# Altium project Sayma_RTM.PrjPcb (part 6 of 11)

## Sheet SI5324_CDR_WR_clocks.SchDoc: Sayma RTM
size 420 x 297 mm; $$Internal___BlkDate: 23:43:25_12-13-18; $$Internal_NAME_PLACEHOLDER: a3sheet; $$Internal_Resolution: 00001mm; $$NotCommonProperty_@NAME: SI5324_CLK_RECOVERY; $$NotCommonProperty_@PRINTORDER: 22; $$NotCommonProperty_@SHEET: 1; $$NotCommonProperty_@SHEETTOTAL: 16; CmpIndex: 26; Drawing Author: G.Kasprowicz; Drawing Number: Sayma RTM; Drawing Project: 8 channel SAWG; Drawing Revision: 2.0; SymIndex: 2227; Author: G.Kasprowicz; CompanyName: WUT ISE; DrawnBy: G.Kasprowicz; Organization: WUT ISE; Address1: PW ISE; Address2: Nowowiejska 15/19 00-665 Warsaw; Address3: gkasprow@gmail.com; DocumentNumber: 4; Revision: 1.0; SheetNumber: 4; SheetTotal: 18; ModifiedBy: -; CheckedDate: -; Title2: CDR (Si5324) & WR clocks; DivGrp: WUT ISE; Designer: G.Kasprowicz; ModifiedDate: -; ProjectName: Sensor Box
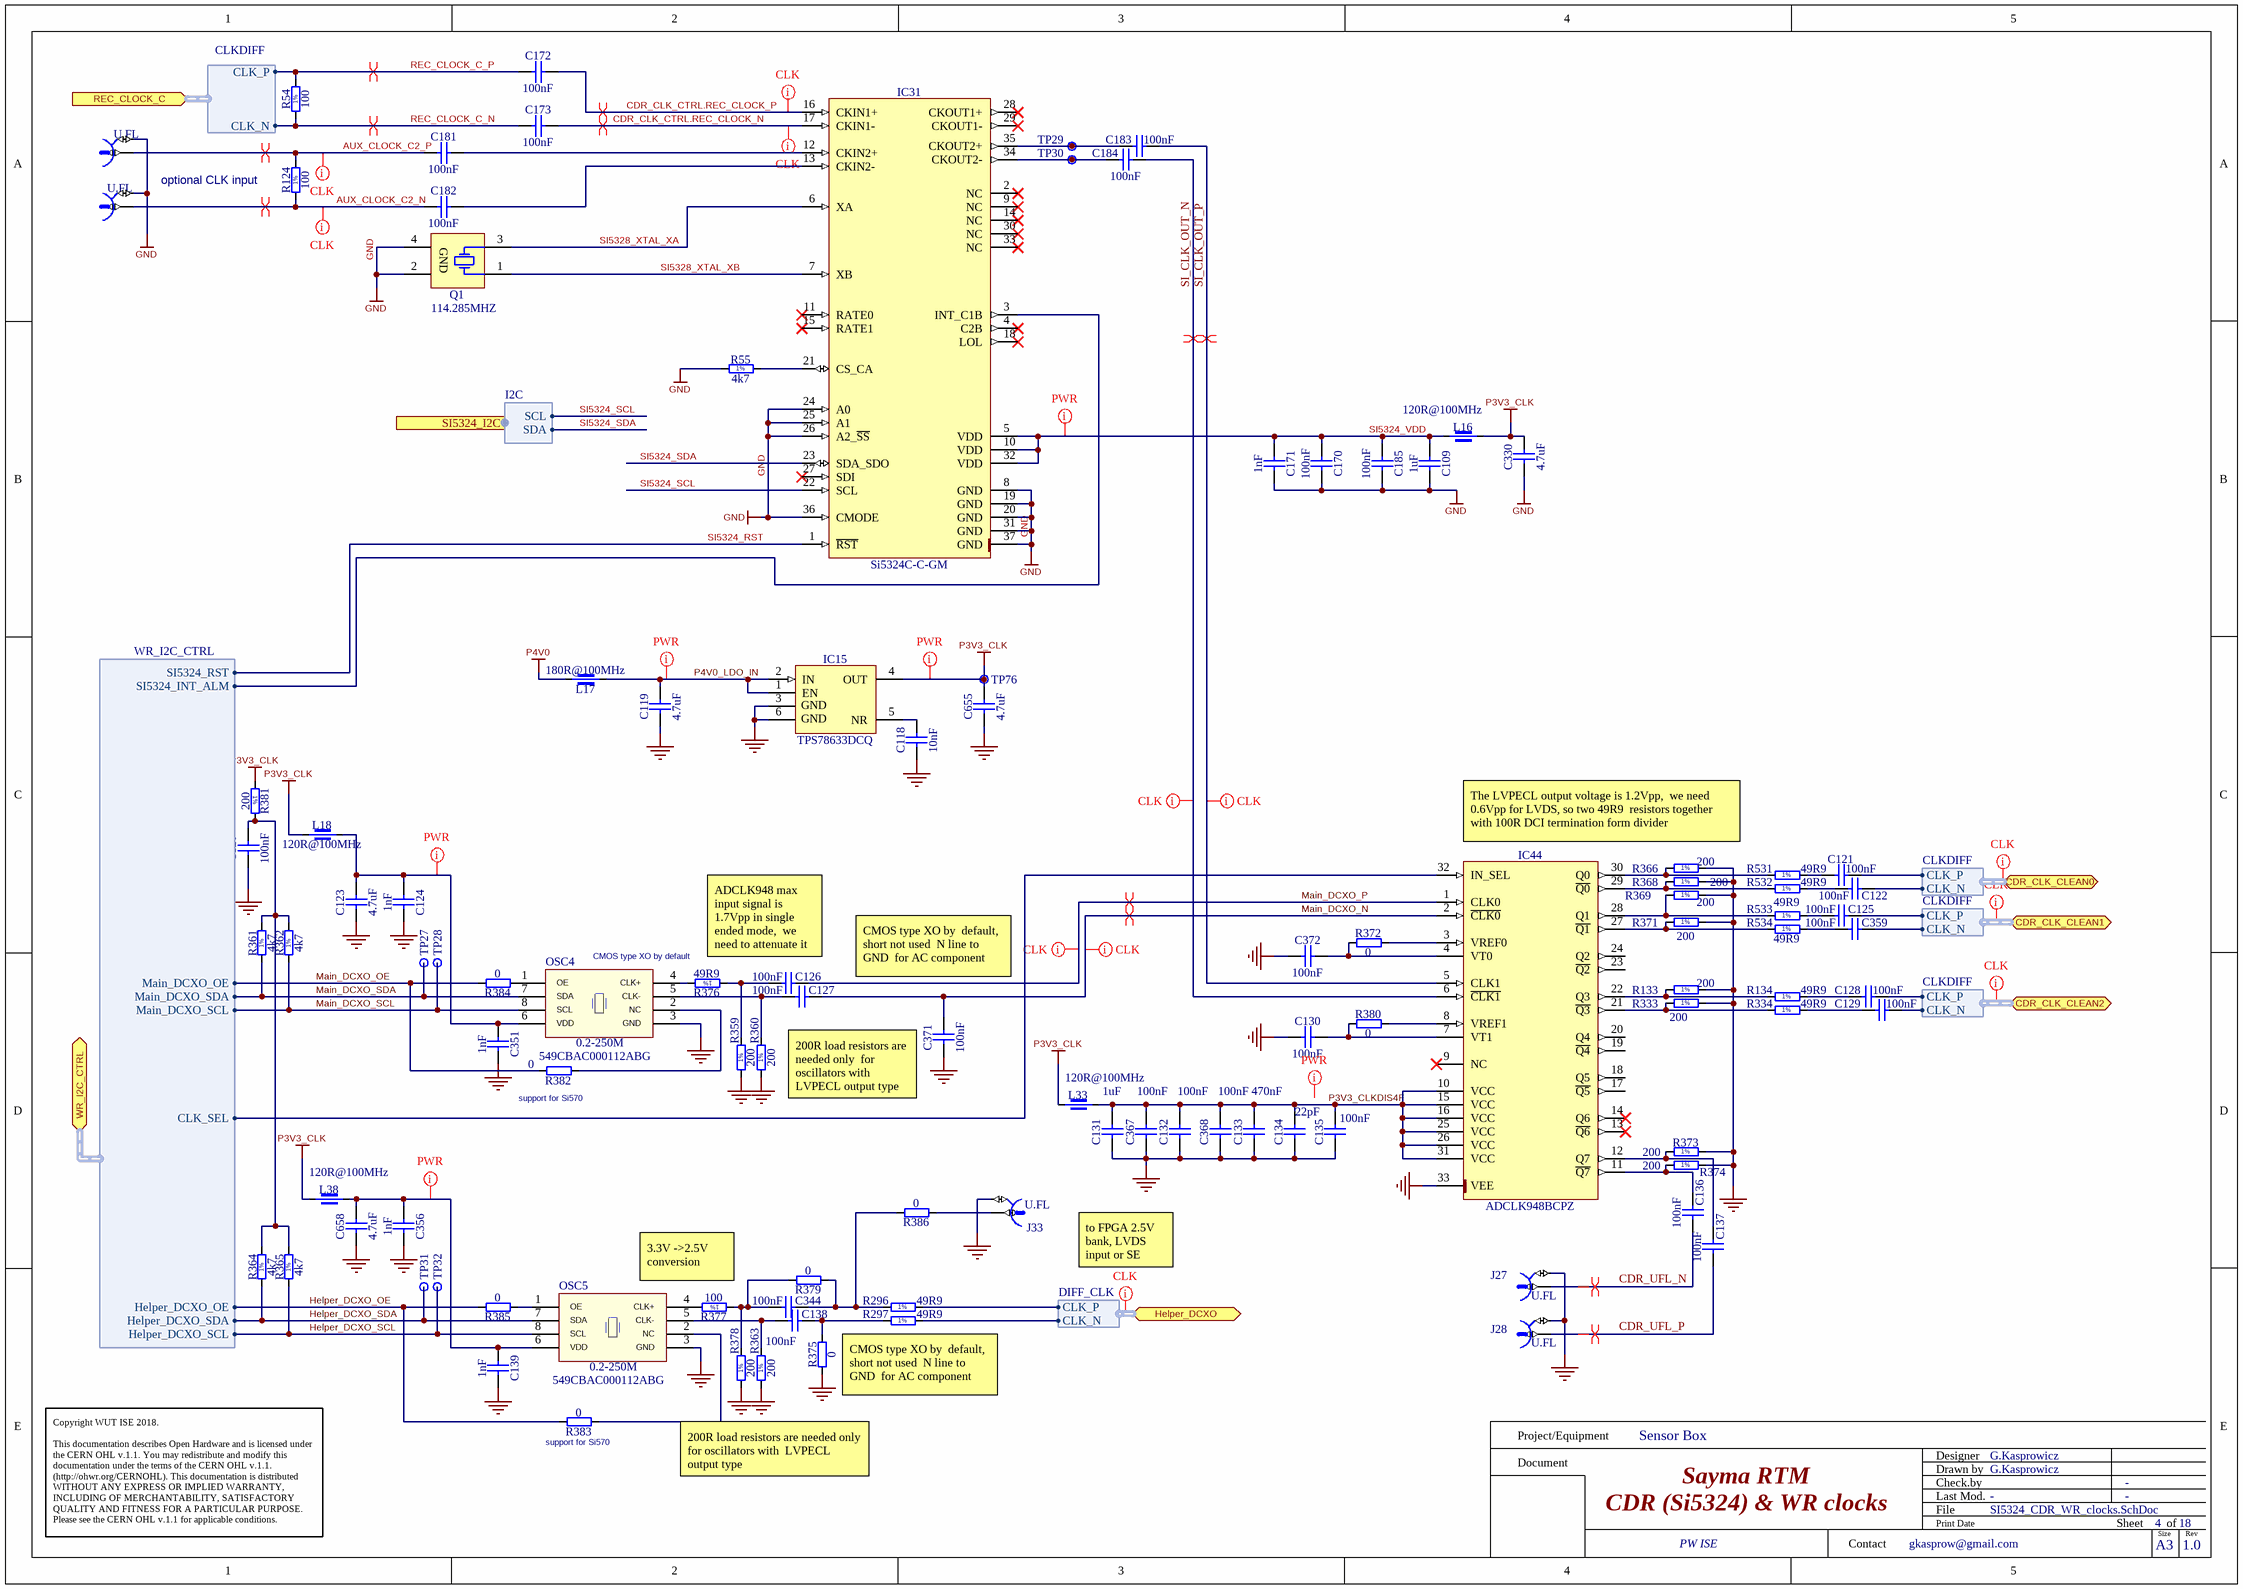
[diagram p9: SI5324_CDR_WR_clocks.SchDoc]

### Parts
C109  1uF  [CAPC1005X55N]
C118  10nF  [CAPC1608X87N]
C119  4.7uF  [CAPC1608X90N]
C120  100nF  [CAPC0603X33N]
C121  100nF  [CAPC0603X33N]
C122  100nF  [CAPC0603X33N]
C123  4.7uF  [CAPC1608X90N]
C124  1nF  [CAPC0603X33N]
C125  100nF  [CAPC0603X33N]
C126  100nF  [CAPC1005X55N]
C127  100nF  [CAPC1005X55N]
C128  100nF  [CAPC0603X33N]
C129  100nF  [CAPC0603X33N]
C130  100nF  [CAPC0603X33N]
C131  1uF  [CAPC1005X55N]
C132  100nF  [CAPC0603X33N]
C133  470nF  [CAPC1005X55N]
C134  22pF  [CAPC1005X55N]
C135  100nF  [CAPC0603X33N]
C136  100nF  [CAPC0603X33N]
C137  100nF  [CAPC0603X33N]
C138  100nF  [CAPC1005X55N]
C139  1nF  [CAPC0603X33N]
C170  100nF  [CAPC0603X33N]
C171  1nF  [CAPC0603X33N]
C172  100nF  [CAPC0603X33N]
C173  100nF  [CAPC0603X33N]
C181  100nF  [CAPC0603X33N]
C182  100nF  [CAPC0603X33N]
C183  100nF  [CAPC0603X33N]
C184  100nF  [CAPC0603X33N]
C185  100nF  [CAPC0603X33N]
C330  4.7uF  [CAPC1608X90N]
C344  100nF  [CAPC1005X55N]
C351  1nF  [CAPC0603X33N]
C356  1nF  [CAPC0603X33N]
C359  100nF  [CAPC0603X33N]
C367  100nF  [CAPC0603X33N]
C368  100nF  [CAPC0603X33N]
C371  100nF  [CAPC0603X33N]
C372  100nF  [CAPC0603X33N]
C655  4.7uF  [CAPC1608X90N]
C658  4.7uF  [CAPC1608X90N]
IC15  TPS78633DCQ  [SOT127P700X180-6N]
IC31  Si5324C-C-GM  [QFN50P600X600X90-37N-S425]
IC44  ADCLK948BCPZ  [QFN50P500X500X80-33N-S285]
J5  U.FL  [HIROSE_U.FL-R-SMT-1(10)]
J6  U.FL  [HIROSE_U.FL-R-SMT-1(10)]
J27  U.FL  [HIROSE_U.FL-R-SMT-1(10)]
J28  U.FL  [HIROSE_U.FL-R-SMT-1(10)]
J33  U.FL  [HIROSE_U.FL-R-SMT-1(10)]
L16  120R@100MHz  [INDC1608X95N]
L17  180R@100MHz  [INDC4516X180N]
L18  120R@100MHz  [INDC1608X95N]
L33  120R@100MHz  [INDC1608X95N]
L38  120R@100MHz  [INDC1608X95N]
OSC4  0.2-250M  Manufacturer Part Number: 549CBAC000112ABG  [OSC_SILICON-LAB_SI549]
OSC5  0.2-250M  Manufacturer Part Number: 549CBAC000112ABG  [OSC_SILICON-LAB_SI549]
Q1  114.285MHZ  [XTAL_CONNOR_CS]
R54  100  [RESC1005X40N]
R55  4k7  [RESC1005X40N]
R124  100  [RESC1005X40N]
R133  200  [RESC1005X40N]
R134  49R9  [RESC1005X40N]
R296  49R9  [RESC1005X40N]
R297  49R9  [RESC1005X40N]
R333  200  [RESC1005X40N]
R334  49R9  [RESC1005X40N]
R359  200  [RESC1005X40N]
R360  200  [RESC1005X40N]
R361  4k7  [RESC1005X40N]
R362  4k7  [RESC1005X40N]
R363  200  [RESC1005X40N]
R364  4k7  [RESC1005X40N]
R365  4k7  [RESC1005X40N]
R366  200  [RESC1005X40N]
R368  200  [RESC1005X40N]
R369  200  [RESC1005X40N]
R371  200  [RESC1005X40N]
R372  0  [RESC1005X40N]
R373  200  [RESC1005X40N]
R374  200  [RESC1005X40N]
R375  0  [RESC1005X40N]
R376  49R9  [RESC1005X40N]
R377  100  [RESC1005X40N]
R378  200  [RESC1005X40N]
R379  0  [RESC1005X40N]
R380  0  [RESC1005X40N]
R381  200  [RESC1005X40N]
R382  0  [RESC1005X40N]
R383  0  [RESC1005X40N]
R384  0  [RESC1005X40N]
R385  0  [RESC1005X40N]
R386  0  [RESC1005X40N]
R531  49R9  [RESC1005X40N]
R532  49R9  [RESC1005X40N]
R533  49R9  [RESC1005X40N]
R534  49R9  [RESC1005X40N]
TP27  Test Point  [TPS127]  (value not drawn)
TP28  Test Point  [TPS127]  (value not drawn)
TP29  Test Point  [TPS127]  (value not drawn)
TP30  Test Point  [TPS127]  (value not drawn)
TP31  Test Point  [TPS127]  (value not drawn)
TP32  Test Point  [TPS127]  (value not drawn)
TP76  Test Point  [TPS127]  (value not drawn)

### Ports
CDR_CLK_CLEAN0 (bidir, harness CLKDIFF), CDR_CLK_CLEAN1 (bidir, harness CLKDIFF), CDR_CLK_CLEAN2 (bidir, harness CLKDIFF), Helper_DCXO (bidir, harness DIFF_CLK), REC_CLOCK_C (in, harness CLKDIFF), SI5324_I2C (harness I2C), WR_I2C_CTRL (bidir, harness WR_I2C_CTRL)

### Harnesses
I2C: SDA, SCL
CLKDIFF: CLK_N, CLK_P
DIFF_CLK: CLK_N, CLK_P
WR_I2C_CTRL: Main_DCXO_OE, Main_DCXO_SDA, Main_DCXO_SCL, Helper_DCXO_OE, Helper_DCXO_SDA, Helper_DCXO_SCL, CLK_SEL, SI5324_RST, SI5324_INT_ALM

### Nets
GND: C109.2 C118.1 C119.1 C120.1 C123.1 C124.1 C130.1 C131.2 C132.1 C133.1 C134.1 C135.1 C139.1 C170.1 C171.1 C185.1 C330.1 C351.1 C356.1 C367.1 C368.1 C371.1 C372.1 C655.1 C658.1 IC15.3(GND) IC15.6(GND) IC31.8(GND) IC31.19(GND) IC31.20(GND) IC31.24(A0) IC31.25(A1) IC31.26(A2_~{SS}) IC31.31(GND) IC31.36(CMODE) IC31.37(GND) IC44.33(VEE) J5.2 J6.2 J27.2 J28.2 J33.2 OSC4.3(GND) OSC5.3(GND) Q1.2(GND) Q1.4(GND) R55.1 R133.2 R333.2 R359.1 R360.1 R363.1 R366.2 R368.2 R369.2 R371.2 R373.2 R374.2 R375.1 R378.1
P3V3_CLK: C330.2 C655.2 IC15.4(OUT) L16.1 L18.1 L33.1 L38.1 R381.1 TP76.1
P4V0: L17.1
AUX_CLOCK_C2_N: C182.2 J6.1 R124.1
AUX_CLOCK_C2_P: C181.2 J5.1 R124.2
CDR_CLK_CLEAN2_N: C129.2 ; port CDR_CLK_CLEAN2.CLK_N
CDR_CLK_CLEAN2_P: C128.2 ; port CDR_CLK_CLEAN2.CLK_P
CDR_CLK_CLEAN3_N: C122.2 ; port CDR_CLK_CLEAN0.CLK_N
CDR_CLK_CLEAN3_P: C121.2 ; port CDR_CLK_CLEAN0.CLK_P
CDR_CLK_CTRL.CDR_CLK_CLEAN1_N: C359.2 ; port CDR_CLK_CLEAN1.CLK_N
CDR_CLK_CTRL.CDR_CLK_CLEAN1_P: C125.2 ; port CDR_CLK_CLEAN1.CLK_P
CDR_CLK_CTRL.REC_CLOCK_N: C173.1 IC31.17(CKIN1-)
CDR_CLK_CTRL.REC_CLOCK_P: C172.1 IC31.16(CKIN1+)
CDR_UFL_N: C136.2 J27.1
CDR_UFL_P: C137.2 J28.1
Helper_DCXO_N: R297.2 ; port Helper_DCXO.CLK_N
Helper_DCXO_OE: R383.2 R385.2 ; port WR_I2C_CTRL.Helper_DCXO_OE
Helper_DCXO_P: R296.2 ; port Helper_DCXO.CLK_P
Helper_DCXO_SCL: OSC5.8(SCL) R365.1 TP32.1 ; port WR_I2C_CTRL.Helper_DCXO_SCL
Helper_DCXO_SDA: OSC5.7(SDA) R364.1 TP31.1 ; port WR_I2C_CTRL.Helper_DCXO_SDA
Main_DCXO_N: C127.2 C371.2 IC44.2(~{CLK0})
Main_DCXO_OE: R382.2 R384.2 ; port WR_I2C_CTRL.Main_DCXO_OE
Main_DCXO_P: C126.2 IC44.1(CLK0)
Main_DCXO_SCL: OSC4.8(SCL) R362.1 TP28.1 ; port WR_I2C_CTRL.Main_DCXO_SCL
Main_DCXO_SDA: OSC4.7(SDA) R361.1 TP27.1 ; port WR_I2C_CTRL.Main_DCXO_SDA
P3V3_CLKDIS4F: C131.1 C132.2 C133.2 C134.2 C135.2 C367.2 C368.2 IC44.10(VCC) IC44.15(VCC) IC44.16(VCC) IC44.25(VCC) IC44.26(VCC) IC44.31(VCC) L33.2
P4V0_LDO_IN: C119.2 IC15.1(EN) IC15.2(IN) L17.2
REC_CLOCK_C_N: C173.2 R54.1 ; port REC_CLOCK_C.CLK_N
REC_CLOCK_C_P: C172.2 R54.2 ; port REC_CLOCK_C.CLK_P
SI5324_INT_ALM: IC31.3(INT_C1B) ; port WR_I2C_CTRL.SI5324_INT_ALM
SI5324_RST: IC31.1(~{RST}) ; port WR_I2C_CTRL.SI5324_RST
SI5324_SCL: IC31.22(SCL) ; port SI5324_I2C.SCL  [project net Si5324_I2C.SCL]
SI5324_SDA: IC31.23(SDA_SDO) ; port SI5324_I2C.SDA  [project net Si5324_I2C.SDA]
SI5324_VDD: C109.1 C170.2 C171.2 C185.2 IC31.5(VDD) IC31.10(VDD) IC31.32(VDD) L16.2
SI5328_XTAL_XA: IC31.6(XA) Q1.3(X)
SI5328_XTAL_XB: IC31.7(XB) Q1.1(X)
SI_CLK_OUT_N: C184.1 IC44.6(~{CLK1})
SI_CLK_OUT_P: C183.1 IC44.5(CLK1)
WR_CLK_SEL: IC44.32(IN_SEL) ; port WR_I2C_CTRL.CLK_SEL
NetC118_2: C118.2 IC15.5(NR)
NetC120_2: C120.2 R361.2 R362.2 R364.2 R365.2 R381.2
NetC121_1: C121.1 R531.2
NetC122_1: C122.1 R532.2
NetC123_2: C123.2 C124.2 C351.2 L18.2 OSC4.6(VDD)
NetC125_1: C125.1 R533.2
NetC126_1: C126.1 R359.2 R376.1
NetC127_1: C127.1 OSC4.5(CLK-) R360.2
NetC128_1: C128.1 R134.2
NetC129_1: C129.1 R334.2
NetC130_2: C130.2 IC44.7(VT1) R380.1
NetC136_1: C136.1 IC44.11(~{Q7}) R374.1
NetC137_1: C137.1 IC44.12(Q7) R373.1
NetC138_1: C138.1 OSC5.5(CLK-) R363.2
NetC138_2: C138.2 R297.1 R375.2
NetC139_2: C139.2 C356.2 C658.2 L38.2 OSC5.6(VDD)
NetC181_1: C181.1 IC31.12(CKIN2+)
NetC182_1: C182.1 IC31.13(CKIN2-)
NetC183_2: C183.2 IC31.35(CKOUT2+) TP29.1
NetC184_2: C184.2 IC31.34(CKOUT2-) TP30.1
NetC344_1: C344.1 R377.1 R378.2 R379.2
NetC344_2: C344.2 R296.1 R379.1 R386.2
NetC359_1: C359.1 R534.2
NetC372_2: C372.2 IC44.4(VT0) R372.1
NetIC31_21: IC31.21(CS_CA) R55.2
NetIC44_3: IC44.3(VREF0) R372.2
NetIC44_8: IC44.8(VREF1) R380.2
NetIC44_21: IC44.21(~{Q3}) R333.1 R334.1
NetIC44_22: IC44.22(Q3) R133.1 R134.1
NetIC44_27: IC44.27(~{Q1}) R371.1 R534.1
NetIC44_28: IC44.28(Q1) R369.1 R533.1
NetIC44_29: IC44.29(~{Q0}) R368.1 R532.1
NetIC44_30: IC44.30(Q0) R366.1 R531.1
NetJ33_1: J33.1 R386.1
NetOSC4_1: OSC4.1(OE) R384.1
NetOSC4_2: OSC4.2(NC) R382.1
NetOSC4_4: OSC4.4(CLK+) R376.2
NetOSC5_1: OSC5.1(OE) R385.1
NetOSC5_2: OSC5.2(NC) R383.1
NetOSC5_4: OSC5.4(CLK+) R377.2

Not connected (* = marked no-connect by the designer): IC31 2(NC)* 4(C2B)* 9(NC)* 11(RATE0)* 14(NC)* 15(RATE1)* 18(LOL)* 27(SDI)* 28(CKOUT1+)* 29(CKOUT1-)* 30(NC)* 33(NC)*; IC44 9(NC)* 13(~{Q6})* 14(Q6)* 17(~{Q5}) 18(Q5) 19(~{Q4}) 20(Q4) 23(~{Q2}) 24(Q2)

### Layout directives
net class CLK: (no net found under the mark), AUX_CLOCK_C2_N, AUX_CLOCK_C2_P, CDR_CLK_CTRL.REC_CLOCK_N, CDR_CLK_CTRL.REC_CLOCK_P, Main_DCXO_N, Main_DCXO_P, SI_CLK_OUT_N, SI_CLK_OUT_P
differential pair: AUX_CLOCK_C2_N, AUX_CLOCK_C2_P, CDR_CLK_CTRL.REC_CLOCK_N, CDR_CLK_CTRL.REC_CLOCK_P, CDR_UFL_N, CDR_UFL_P, Main_DCXO_N, Main_DCXO_P, REC_CLOCK_C_N, REC_CLOCK_C_P, SI_CLK_OUT_N, SI_CLK_OUT_P
net class PWR: (no net found under the mark), NetC123_2, NetC139_2, P3V3_CLK, P4V0_LDO_IN, SI5324_VDD

### Notes on the sheet
- (near R124) optional CLK input
- The LVPECL output voltage is 1.2Vpp,  we need 0.6Vpp for LVDS, so two 49R9  resistors together with 100R DCI termination form divider
- CMOS type XO by default
- ADCLK948 max input signal is 1.7Vpp in single  ended mode,  we need to attenuate it
- CMOS type XO by  default, short not used  N line to GND  for AC component
- (near R382) support for Si570
- 200R load resistors are needed only  for oscillators with  LVPECL output type
- to FPGA 2.5V bank, LVDS input or SE mode
- 3.3V ->2.5V  conversion
- (near R383) support for Si570
- Project/Equipment
- Document
- Designer
- Drawn by
- Check.by
- Copyright WUT ISE 2018.
  This documentation describes Open Hardware and is licensed under the CERN OHL v.1.1. You may redistribute and modify this documentation under the terms of the CERN OHL v.1.1. (http://ohwr.org/CERNOHL). This documentation is distributed WITHOUT ANY EXPRESS OR IMPLIED WARRANTY, INCLUDING OF MERCHANTABILITY, SATISFACTORY QUALITY AND FITNESS FOR A PARTICULAR PURPOSE. Please see the CERN OHL v.1.1 for applicable conditions.
- Contact
- File
- Last Mod.
- Print Date
- Sheet
- Size
- A3
- of
- Rev
- (in symbol R0402_4K7_1%_0.0625W_100PPM) 1%
- (in symbol R0402_49R9_1%_0.0625W_100PPM) 1%
- (in symbol R0402_100R_1%_0.0625W_100PPM) 1%
- (in symbol R0402_200R_1%_0.0625W_100PPM) 1%

### Library data of the parts
C109 = CC0402_1UF_16V_10%_X5R: Non-polarised capacitor; Manufacturer: GENERIC; Manufacturer1 Part Number: C1005X5R1C105KT; Part Description: SMD Multilayer Chip Ceramic Capacitor; TC: X5R; Tolerance: ±10%; Voltage: 16V; Case: 0402; Manufacturer Part Number: CC0402_1UF_16V_10%_X5R; Manufacturer1 Example: TDK; Part Number: CC0402_1UF_16V_10%_X5R; Pin Count: 2; SMD: Yes; Status: Preferred; Value: 1uF; Component Kind: Standard; Component Type: Standard; Mounted: Yes; Socket: No; Sense: No; Manufacturer1 ComponentHeight: 0.55mm; HelpURL: \\cern.ch\dfs\Applications\Altium\Datasheets\CC0402_X5R_TDK_C.pdf; Author: CERN DEM JLC; CreateDate: 25.10.2012; LatestRevisionDate: 25.10.2012
C118 = CC0603_10NF_50V_5%_C0G: Non-polarised capacitor; Part Description: SMD Multilayer Chip Ceramic Capacitor; Manufacturer: GENERIC; Manufacturer1 Part Number: C1608C0G1H103J080AA; Voltage: 50V; TC: C0G/NP0; Tolerance: ±5%; Part Number: CC0603_10NF_50V_5%_C0G; Component Kind: Standard; Component Type: Standard; Pin Count: 2; Value: 10nF; Status: Preferred; Manufacturer Part Number: CC0603_10NF_50V_5%_C0G; Case: 0603; Mounted: Yes; Socket: No; SMD: Yes; Sense: No; Manufacturer1 Example: TDK; Manufacturer1 ComponentHeight: 0.9mm; HelpURL: \\cern.ch\dfs\Applications\Altium\Datasheets\CC0603_C0G_TDK_C.pdf; Author: CERN DEM JLC; CreateDate: 10.12.2014; LatestRevisionDate: 10.12.2014
C119 C123 C655 C658 = CC0603_4.7UF_25V_10%_X5R: Non-polarised capacitor; Manufacturer: GENERIC; Part Description: SMD Multilayer Chip Ceramic Capacitor; Manufacturer1 Part Number: GRM188R61E475KE11D; Tolerance: ±10%; Voltage: 25V; TC: X5R; Manufacturer Part Number: CC0603_4.7UF_25V_10%_X5R; Part Number: CC0603_4.7UF_25V_10%_X5R; Value: 4.7uF; Component Kind: Standard; Component Type: Standard; Pin Count: 2; Status: None; Case: 0603; Mounted: Yes; Socket: No; SMD: Yes; Sense: No; Manufacturer1 Example: MURATA; Manufacturer1 ComponentHeight: 0.95mm; HelpURL: \\cern.ch\dfs\Applications\Altium\Datasheets\CC0603_MURATA_GRM188R61E475KE11D.pdf; Author: CERN DEM JLC; CreateDate: 10.11.2014; LatestRevisionDate: 10.11.2014
C120-C122 C125 C128-C130 C132 C135-C137 C359 C367 C368 C371 C372 = CC0201_100NF_6.3V_10%_X5R: Non-polarised capacitor; Manufacturer: GENERIC; Part Description: SMD Multilayer Chip Ceramic Capacitor; Manufacturer1 Part Number: 02016D104KAT2A; Tolerance: ±10%; Voltage: 6.3V; TC: X5R; Manufacturer Part Number: CC0201_100NF_6.3V_10%_X5R; Part Number: CC0201_100NF_6.3V_10%_X5R; Value: 100nF; Component Kind: Standard; Component Type: Standard; Pin Count: 2; Status: Not Recommended; Case: 0201; Mounted: Yes; Socket: No; SMD: Yes; Sense: No; Manufacturer1 Example: AVX; Manufacturer1 ComponentHeight: 0.33mm; HelpURL: \\cern.ch\dfs\Applications\Altium\Datasheets\CC0201_X5R_AVX.pdf; Author: CERN DEM JLC; CreateDate: 03.12.2007; LatestRevisionDate: 03.12.2007
C124 C139 C351 C356 = CC0201_1NF_16V_10%_X5R: Non-polarised capacitor; Manufacturer: GENERIC; Part Description: SMD Multilayer Chip Ceramic Capacitor; Manufacturer1 Part Number: 0201YD102KAT2A; Tolerance: ±10%; Voltage: 16V; TC: X5R; Manufacturer Part Number: CC0201_1NF_16V_10%_X5R; Part Number: CC0201_1NF_16V_10%_X5R; Value: 1nF; Component Kind: Standard; Component Type: Standard; Pin Count: 2; Status: Not Recommended; Case: 0201; Mounted: Yes; Socket: No; SMD: Yes; Sense: No; Manufacturer1 Example: AVX; Manufacturer1 ComponentHeight: 0.33mm; HelpURL: \\cern.ch\dfs\Applications\Altium\Datasheets\CC0201_X5R_AVX.pdf; Author: CERN DEM JLC; CreateDate: 03.12.2007; LatestRevisionDate: 03.12.2007
C126 C127 C138 C344 = CC0402_100NF_16V_10%_X5R: as C445 on sheet PWR_buck_FPGA_EXAR; Case: 0402; Manufacturer Part Number: CC0402_100NF_16V_10%_X5R; Manufacturer1 Example: MURATA; Part Number: CC0402_100NF_16V_10%_X5R; Pin Count: 2; SMD: Yes; Status: None; Value: 100nF; Component Kind: Standard; Component Type: Standard; Mounted: Yes; Socket: No; Sense: No; Manufacturer1 ComponentHeight: 0.55mm; HelpURL: \\cern.ch\dfs\Applications\Altium\Datasheets\CC0402_X5R_MURATA_GRM.pdf; Author: CERN DEM JLC; CreateDate: 10.12.2013; LatestRevisionDate: 10.12.2013
C131 = CC0402_1UF_16V_10%_X5R: Non-polarised capacitor; Manufacturer: GENERIC; Part Description: SMD Multilayer Chip Ceramic Capacitor; Manufacturer1 Part Number: C1005X5R1C105KT; Tolerance: ±10%; Voltage: 16V; TC: X5R; Manufacturer Part Number: CC0402_1UF_16V_10%_X5R; Part Number: CC0402_1UF_16V_10%_X5R; Value: 1uF; Component Kind: Standard; Component Type: Standard; Pin Count: 2; Status: Preferred; Case: 0402; Mounted: Yes; Socket: No; SMD: Yes; Sense: No; Manufacturer1 Example: TDK; Manufacturer1 ComponentHeight: 0.55mm; HelpURL: \\cern.ch\dfs\Applications\Altium\Datasheets\CC0402_X5R_TDK_C.pdf; Author: CERN DEM JLC; CreateDate: 25.10.2012; LatestRevisionDate: 25.10.2012
C133 = CC0402_470NF_16V_10%_X5R: Non-polarised capacitor; Manufacturer: GENERIC; Part Description: SMD Multilayer Chip Ceramic Capacitor; Manufacturer1 Part Number: C1005X5R1C105KT; Tolerance: ±10%; Voltage: 16V; TC: X5R; Manufacturer Part Number: CC0402_470NF_16V_10%_X5R; Part Number: CC0402_470NF_16V_10%_X5R; Value: 470nF; Component Kind: Standard; Component Type: Standard; Pin Count: 2; Status: Preferred; Case: 0402; Mounted: Yes; Socket: No; SMD: Yes; Sense: No; Manufacturer1 Example: TDK; Manufacturer1 ComponentHeight: 0.55mm; HelpURL: \\cern.ch\dfs\Applications\Altium\Datasheets\CC0402_X5R_TDK_C.pdf; Author: CERN DEM JLC; CreateDate: 25.10.2012; LatestRevisionDate: 25.10.2012
C134 = CC0402_22PF_50V_5%_C0G: Non-polarised capacitor; Manufacturer: GENERIC; Part Description: SMD Multilayer Chip Ceramic Capacitor; Manufacturer1 Part Number: C0402C220J5GACTU; Tolerance: ±5%; Voltage: 50V; TC: C0G/NP0; Manufacturer Part Number: CC0402_22PF_50V_5%_C0G; Part Number: CC0402_22PF_50V_5%_C0G; Value: 22pF; Component Kind: Standard; Component Type: Standard; Pin Count: 2; Status: Preferred; Case: 0402; Mounted: Yes; Socket: No; SMD: Yes; Sense: No; Manufacturer1 Example: KEMET; Manufacturer1 ComponentHeight: 0.55mm; HelpURL: \\cern.ch\dfs\Applications\Altium\Datasheets\CC0805_C0G_KEMET_(Commercial Grade).pdf; Author: CERN DEM JLC; CreateDate: 03.12.2007; LatestRevisionDate: 03.12.2007
C170 C172 C173 C181-C185 = CC0201_100NF_6.3V_10%_X5R: as C193 on sheet PWR_buck_FPGA_EXAR; Case: 0201; Manufacturer Part Number: CC0201_100NF_6.3V_10%_X5R; Manufacturer1 Example: AVX; Part Number: CC0201_100NF_6.3V_10%_X5R; Pin Count: 2; SMD: Yes; Status: Not Recommended; Value: 100nF; Component Kind: Standard; Component Type: Standard; Mounted: Yes; Socket: No; Sense: No; Manufacturer1 ComponentHeight: 0.33mm; HelpURL: \\cern.ch\dfs\Applications\Altium\Datasheets\CC0201_X5R_AVX.pdf; Author: CERN DEM JLC; CreateDate: 03.12.2007; LatestRevisionDate: 03.12.2007
C171 = CC0201_1NF_16V_10%_X5R: Non-polarised capacitor; Manufacturer: GENERIC; Manufacturer1 Part Number: 0201YD102KAT2A; Part Description: SMD Multilayer Chip Ceramic Capacitor; Tolerance: ±10%; Voltage: 16V; TC: X5R; Case: 0201; Manufacturer Part Number: CC0201_1NF_16V_10%_X5R; Manufacturer1 Example: AVX; Part Number: CC0201_1NF_16V_10%_X5R; Pin Count: 2; SMD: Yes; Value: 1nF; Component Kind: Standard; Component Type: Standard; Status: Not Recommended; Mounted: Yes; Socket: No; Sense: No; Manufacturer1 ComponentHeight: 0.33mm; HelpURL: \\cern.ch\dfs\Applications\Altium\Datasheets\CC0201_X5R_AVX.pdf; Author: CERN DEM JLC; CreateDate: 03.12.2007; LatestRevisionDate: 03.12.2007
C330 = CC0603_4.7UF_25V_10%_X5R: as C334 on sheet PWR_buck_FPGA_EXAR; Case: 0603; Manufacturer Part Number: CC0603_4.7UF_25V_10%_X5R; Manufacturer1 Example: MURATA; Part Number: CC0603_4.7UF_25V_10%_X5R; Pin Count: 2; SMD: Yes; Value: 4.7uF; Component Kind: Standard; Component Type: Standard; Status: None; Mounted: Yes; Socket: No; Sense: No; Manufacturer1 ComponentHeight: 0.95mm; HelpURL: \\cern.ch\dfs\Applications\Altium\Datasheets\CC0603_MURATA_GRM188R61E475KE11D.pdf; Author: CERN DEM JLC; CreateDate: 10.11.2014; LatestRevisionDate: 10.11.2014
IC15 = TPS78633DCQ: Ultralow-Noise, High-PSRR, Fast, RF, 1.5A Low-Dropout Linear Regulator; Part Description: 3.3V Ultralow-Noise, High-PSRR, Fast, RF, 1.5A Low-Dropout Linear Regulator; Manufacturer: TEXAS INSTRUMENTS; PressFit: No; Bonding: No; Part Number: TPS78633DCQ; Component Kind: Standard; Component Type: Standard; Device: TPS78633DCQ; PackageDescription: SOT223, 6-Leads, Body 6.6x7.3mm (max), Pitch 1.27mm, IPC Medium Density; Manufacturer Part Number: TPS78633DCQ; Pin Count: 6; Case: SOT223; Mounted: Yes; Socket: No; SMD: Yes; Sense: No; ComponentHeight: 1.8mm; HelpURL: \\cern.ch\dfs\Applications\Altium\Datasheets\TPS78633DCQ.pdf; Author: CERN DEM JMW; CreateDate: 07.10.2008; LatestRevisionDate: 13.02.2017
IC31 = Si5324C-C-GM: Any Frequency Precision Clock Multiplier/Jitter Attenuator; Manufacturer: SILICON LABS; PressFit: No; Bonding: No; ComponentHeight: 0.9mm; Device: Si5324C-C-GM; Manufacturer Part Number: Si5324C-C-GM; PackageDescription: QFN, 0.50mm Pitch, Square; 36 Pin, 6.00mm L X 6.00mm W X 0.90mm H Body (w/thermal tab 4.25mm x 4.25mm), IPC Medium Density; Part Description: Any Frequency Precision Clock Multiplier/Jitter Attenuator; Part Number: Si5324C-C-GM; Pin Count: 37; SMD: Yes; Component Kind: Standard; Component Type: Standard; Case: QFN36; Mounted: Yes; Socket: No; Sense: No; HelpURL: \\cern.ch\dfs\Applications\Altium\Datasheets\Si5324C-C-GM.pdf; Author: CERN DEM JLC; CreateDate: 19.08.2013; LatestRevisionDate: 19.08.2013
IC44 = ADCLK948BCPZ: Two Selectable Inputs, 8 LVPECL Outputs, SiGe Clock Fanout Buffer; Manufacturer: ANALOG DEVICES; PressFit: No; Bonding: No; Manufacturer Part Number: ADCLK948BCPZ; Part Description: Two Selectable Inputs, 8 LVPECL Outputs, SiGe Clock Fanout Buffer; Part Number: ADCLK948BCPZ; Component Kind: Standard; Component Type: Standard; Device: ADCLK948BCPZ; PackageDescription: QFN, 0.50mm Pitch, Square; 8 Pin X 8 Pin, 5mm X 5mm X 1.00mm H body (w/thermal tab 2.85 X 2.85mm),  IPC Medium Density; Pin Count: 33; Case: QFN32; Mounted: Yes; Socket: No; SMD: Yes; Sense: No; ComponentHeight: 0.8mm; Author: CERN DEM MR; HelpURL: \\cern.ch\dfs\Applications\Altium\Datasheets\ADCLK948BCPZ.pdf; CreateDate: 30.11.2016; LatestRevisionDate: 30.11.2016
J5 J6 J27 J28 J33 = HIROSE_U.FL-R-SMT-1(10): Manufacturer: HIROSE (HRS); Part Description: Up to 6GHz Ultra Small Surface Mount Male Coaxial Connectors U.FL Series; PressFit: No; ComponentHeight: 1.25mm; Family: U.FL; Manufacturer Part Number: U.FL-R-SMT-1(10); Part Number: HIROSE_U.FL-R-SMT-1(10); Pin Count: 2; SMD: Yes; Status: None; Component Kind: Standard; Component Type: Standard; Mounted: Yes; Socket: No; Sense: No; HelpURL: \\cern.ch\dfs\Applications\Altium\Datasheets\HIROSE_U.FL-R-SMT-1(10).pdf; Author: CERN DEM JLC; CreateDate: 24.03.2010; LatestRevisionDate: 24.03.2010
L16 L18 L33 L38 = IND0603_MURATA_BLM18PG121SN1D: as L19 on sheet PWR_buck_FPGA_EXAR; Case: 0603; ComponentHeight: 0.95mm; Manufacturer Part Number: BLM18PG121SN1D; Part Number: IND0603_MURATA_BLM18PG121SN1D; Pin Count: 2; SMD: Yes; Value: 120R@100MHz; Component Kind: Standard; Component Type: Standard; Status: None; Mounted: Yes; Socket: No; Sense: No; HelpURL: \\cern.ch\dfs\Applications\Altium\Datasheets\IND0603_MURATA_BLM18P.pdf; Author: CERN DEM BC; CreateDate: 27.07.2015; LatestRevisionDate: 25.10.2018
L17 = IND1806_MURATA_BLM41PG181SN1L: Manufacturer: MURATA; Part Description: SMD EMI Suppression Chip Ferrite Bead (BLM41P Series); Power: 3.5A; Resistance: 0.02R; Case: 1806; ComponentHeight: 1.8mm; Manufacturer Part Number: BLM41PG181SN1L; Part Number: IND1806_MURATA_BLM41PG181SN1L; Pin Count: 2; SMD: Yes; Value: 180R@100MHz; Component Kind: Standard; Component Type: Standard; Status: None; Mounted: Yes; Socket: No; Sense: No; HelpURL: \\cern.ch\dfs\Applications\Altium\Datasheets\IND1806_MURATA_BLM41P.pdf; Author: CERN DEM JLC; CreateDate: 26.06.2012; LatestRevisionDate: 26.06.2012
OSC4 OSC5 = OSC_SILICON-LAB_SI549: Manufacturer: Silabs; Part Description: Ultra Low Jitter I2C Programmable XO (95 fs), 0.2 to 250MHz; Part Name: OSC_10-280MHZ_SILICON-LAB_Si570BBC000121DG; Part Number: OSC_0.2_250M_SILICON-LAB_549CBAC000112ABG; Value: 0.2-250M
Q1 = XTAL_114.285MHZ_CONNOR_CS-023: Crystal 4 pins 1=XTAL Control 2=GND3=XTAL 4=GND; Manufacturer Part Number: CS-023-114.285M; Manufacturer: CONNOR-WINFIELD; Part Description: ±20ppm 18pF -40°C to +85°C  4 Pins, 3.2x2.5X0.8mm, SMD Crystal Unit, CS-018 Series; Bonding: No; PressFit: No; Author: CERN DEM JLC; Component Kind: Standard; Component Type: Standard; ComponentHeight: 0.8mm; CreateDate: 08.07.2014; HelpURL: \\cern.ch\dfs\Applications\Altium\Datasheets\XTAL_CONNOR_CS-023.pdf; LatestRevisionDate: 08.07.2014; Mounted: Yes; PackageDescription: 4 Pins, 2.5x3.2mm, SMD Sealing Crystal, CS Series; Part Number: XTAL_114.285MHZ_CONNOR_CS-023; Pin Count: 4; Sense: No; SMD: Yes; Socket: No; Value: 114.285MHZ
R54 R124 = R0402_100R_1%_0.0625W_100PPM: Resistor - 1%; Manufacturer: GENERIC; Manufacturer1 Part Number: 232270671001L; Part Description: General Purpose Thick Film Chip Resistor; TC: ±100ppm/°C; PressFit: No; Case: 0402; Manufacturer Part Number: R0402_100R_1%_0.0625W_100PPM; Manufacturer1 ComponentHeight: 0.4mm; Manufacturer1 Example: YAGEO PHYCOMP; Part Number: R0402_100R_1%_0.0625W_100PPM; Pin Count: 2; Power: 0.0625W; Sense: No; SMD: Yes; Status: Not Recommended; Tolerance: ±1%; Value: 100; Component Kind: Standard; Component Type: Standard; Mounted: Yes; Socket: No; HelpURL: \\cern.ch\dfs\Applications\Altium\Datasheets\R0402_Phycomp_RC0402.pdf; Author: CERN DEM JLC; CreateDate: 03.12.2007; LatestRevisionDate: 17.10.2012
R55 = R0402_4K7_1%_0.0625W_100PPM: Resistor - 1%; Manufacturer: GENERIC; Manufacturer1 Part Number: 232270674702L; Part Description: General Purpose Thick Film Chip Resistor; TC: ±100ppm/°C; PressFit: No; Case: 0402; Manufacturer Part Number: R0402_4K7_1%_0.0625W_100PPM; Manufacturer1 ComponentHeight: 0.4mm; Manufacturer1 Example: YAGEO PHYCOMP; Part Number: R0402_4K7_1%_0.0625W_100PPM; Pin Count: 2; Power: 0.0625W; Sense: No; SMD: Yes; Status: Not Recommended; Tolerance: ±1%; Value: 4k7; Component Kind: Standard; Component Type: Standard; Mounted: Yes; Socket: No; HelpURL: \\cern.ch\dfs\Applications\Altium\Datasheets\R0402_Phycomp_RC0402.pdf; Author: CERN DEM JLC; CreateDate: 03.12.2007; LatestRevisionDate: 17.10.2012
R133 R333 R359 R360 R363 R366 R368 R369 R371 R373 R374 R378 R381 = R0402_200R_1%_0.0625W_100PPM: Resistor - 1%; Manufacturer: GENERIC; Part Description: General Purpose Thick Film Chip Resistor; Manufacturer1 Part Number: 232270672001L; TC: ±100ppm/°C; PressFit: No; Manufacturer Part Number: R0402_200R_1%_0.0625W_100PPM; Part Number: R0402_200R_1%_0.0625W_100PPM; Tolerance: ±1%; Value: 200; Component Kind: Standard; Component Type: Standard; Pin Count: 2; Status: Not Recommended; Power: 0.0625W; Case: 0402; Mounted: Yes; Sense: No; Socket: No; SMD: Yes; Manufacturer1 Example: YAGEO PHYCOMP; Manufacturer1 ComponentHeight: 0.4mm; HelpURL: \\cern.ch\dfs\Applications\Altium\Datasheets\R0402_Phycomp_RC0402.pdf; Author: CERN DEM JLC; CreateDate: 03.12.2007; LatestRevisionDate: 17.10.2012
R134 R334 R376 R531-R534 = R0402_49R9_1%_0.0625W_100PPM: Resistor - 1%; Manufacturer: GENERIC; Part Description: General Purpose Thick Film Chip Resistor; Manufacturer1 Part Number: 232270674999L or RC0402FR-0749R9L; TC: ±100ppm/°C; PressFit: No; Manufacturer Part Number: R0402_49R9_1%_0.0625W_100PPM; Part Number: R0402_49R9_1%_0.0625W_100PPM; Tolerance: ±1%; Value: 49R9; Component Kind: Standard; Component Type: Standard; Pin Count: 2; Status: Not Recommended; Power: 0.0625W; Case: 0402; Mounted: Yes; Sense: No; Socket: No; SMD: Yes; Manufacturer1 Example: YAGEO PHYCOMP; Manufacturer1 ComponentHeight: 0.4mm; HelpURL: \\cern.ch\dfs\Applications\Altium\Datasheets\R0402_Phycomp_RC0402.pdf; Author: CERN DEM JLC; CreateDate: 24.10.2012; LatestRevisionDate: 24.10.2012
R296 R297 = R0402_49R9_1%_0.0625W_100PPM: Resistor - 1%; Manufacturer: GENERIC; Part Description: General Purpose Thick Film Chip Resistor; Manufacturer1 Part Number: 232270674999L or RC0402FR-0749R9L; PressFit: No; TC: ±100ppm/°C; Manufacturer Part Number: R0402_49R9_1%_0.0625W_100PPM; Part Number: R0402_49R9_1%_0.0625W_100PPM; Value: 49R9; Component Kind: Standard; Component Type: Standard; Pin Count: 2; Status: Not Recommended; Case: 0402; Mounted: Yes; Sense: No; Socket: No; SMD: Yes; Manufacturer1 Example: YAGEO PHYCOMP; Manufacturer1 ComponentHeight: 0.4mm; HelpURL: \\cern.ch\dfs\Applications\Altium\Datasheets\R0402_Phycomp_RC0402.pdf; Author: CERN DEM JLC; CreateDate: 24.10.2012; LatestRevisionDate: 24.10.2012; Power: 0.0625W; Tolerance: ±1%
R361 R362 R364 R365 = R0402_4K7_1%_0.0625W_100PPM: Resistor - 1%; Manufacturer: GENERIC; Part Description: General Purpose Thick Film Chip Resistor; Manufacturer1 Part Number: 232270674702L; TC: ±100ppm/°C; PressFit: No; Manufacturer Part Number: R0402_4K7_1%_0.0625W_100PPM; Part Number: R0402_4K7_1%_0.0625W_100PPM; Tolerance: ±1%; Value: 4k7; Component Kind: Standard; Component Type: Standard; Pin Count: 2; Status: Not Recommended; Power: 0.0625W; Case: 0402; Mounted: Yes; Sense: No; Socket: No; SMD: Yes; Manufacturer1 Example: YAGEO PHYCOMP; Manufacturer1 ComponentHeight: 0.4mm; HelpURL: \\cern.ch\dfs\Applications\Altium\Datasheets\R0402_Phycomp_RC0402.pdf; Author: CERN DEM JLC; CreateDate: 03.12.2007; LatestRevisionDate: 17.10.2012
R372 R375 R379 R380 R382-R386 = R0402_0R_JUMPER: as R149 on sheet PWR_buck_FPGA_EXAR; Manufacturer Part Number: R0402_0R_JUMPER; Part Number: R0402_0R_JUMPER; Value: 0; Component Kind: Standard; Component Type: Standard; Pin Count: 2; Status: Not Recommended; Case: 0402; Mounted: Yes; Sense: No; Socket: No; SMD: Yes; Manufacturer1 Example: YAGEO PHYCOMP; Manufacturer1 ComponentHeight: 0.4mm; HelpURL: \\cern.ch\dfs\Applications\Altium\Datasheets\R0402_Phycomp_RC0402.pdf; Author: CERN DEM JLC; CreateDate: 03.12.2007; LatestRevisionDate: 17.10.2012
R377 = R0402_100R_1%_0.0625W_100PPM: Resistor - 1%; Manufacturer: GENERIC; Part Description: General Purpose Thick Film Chip Resistor; Manufacturer1 Part Number: 232270671001L; TC: ±100ppm/°C; PressFit: No; Manufacturer Part Number: R0402_100R_1%_0.0625W_100PPM; Part Number: R0402_100R_1%_0.0625W_100PPM; Tolerance: ±1%; Value: 100; Component Kind: Standard; Component Type: Standard; Pin Count: 2; Status: Not Recommended; Power: 0.0625W; Case: 0402; Mounted: Yes; Sense: No; Socket: No; SMD: Yes; Manufacturer1 Example: YAGEO PHYCOMP; Manufacturer1 ComponentHeight: 0.4mm; HelpURL: \\cern.ch\dfs\Applications\Altium\Datasheets\R0402_Phycomp_RC0402.pdf; Author: CERN DEM JLC; CreateDate: 03.12.2007; LatestRevisionDate: 17.10.2012
TP27-TP32 TP76 = SMD_PAD_1.27X1.27MM: as TP47 on sheet PWR_buck_FPGA_EXAR; Part Number: SMD_PAD_1.27X1.27MM; Component Kind: Standard (No BOM); Component Type: Standard (No BOM); Pin Count: 1; Family: Test Point; Socket: No; SMD: Yes; Sense: No; Status: None; ComponentHeight: 0mm; HelpURL: Undefined; Author: CERN DEM JLC; CreateDate: 12.01.2008; LatestRevisionDate: 12.01.2008; PackageDescription: 1.27mm x 1.27mm PCB Copper Area (SMD Test Point)